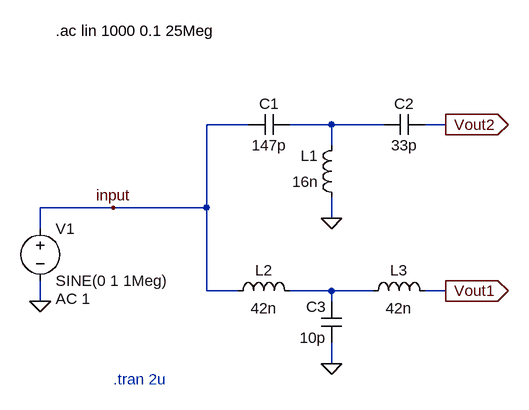
[diagram p0: schematic phase_shifter.asc]
phase_shifter.asc, the LTspice schematic file:
Version 4.1
SHEET 1 880 680
WIRE 80 112 16 112
WIRE 208 112 144 112
WIRE 288 112 208 112
WIRE 384 112 352 112
WIRE 208 144 208 112
WIRE -128 240 -240 240
WIRE 16 240 16 112
WIRE 16 240 -128 240
WIRE 208 256 208 224
WIRE -240 272 -240 240
WIRE 16 368 16 240
WIRE 64 368 16 368
WIRE 208 368 144 368
WIRE 272 368 208 368
WIRE 384 368 352 368
WIRE -240 384 -240 352
WIRE 208 384 208 368
WIRE 208 480 208 448
FLAG 208 256 0
FLAG 208 480 0
FLAG -240 384 0
FLAG 384 112 Vout2
IOPIN 384 112 Out
FLAG 384 368 Vout1
IOPIN 384 368 Out
FLAG -128 240 input
SYMBOL cap 144 96 R90
WINDOW 0 0 32 VBottom 2
WINDOW 3 32 32 VTop 2
SYMATTR InstName C1
SYMATTR Value 147p
SYMBOL cap 352 96 R90
WINDOW 0 0 32 VBottom 2
WINDOW 3 32 32 VTop 2
SYMATTR InstName C2
SYMATTR Value 33p
SYMBOL cap 224 448 R180
WINDOW 0 24 56 Left 2
WINDOW 3 24 8 Left 2
SYMATTR InstName C3
SYMATTR Value 10p
SYMBOL ind 224 240 R180
WINDOW 0 36 80 Left 2
WINDOW 3 36 40 Left 2
SYMATTR InstName L1
SYMATTR Value 16n
SYMBOL ind 48 384 R270
WINDOW 0 32 56 VTop 2
WINDOW 3 5 56 VBottom 2
SYMATTR InstName L2
SYMATTR Value 42n
SYMBOL ind 256 384 R270
WINDOW 0 32 56 VTop 2
WINDOW 3 5 56 VBottom 2
SYMATTR InstName L3
SYMATTR Value 42n
SYMBOL voltage -240 256 R0
WINDOW 123 24 124 Left 2
WINDOW 39 0 0 Left 0
SYMATTR InstName V1
SYMATTR Value SINE(0 1 1Meg)
SYMATTR Value2 AC 1
TEXT -128 504 Left 2 ;.tran 2u
TEXT -216 -32 Left 2 !.ac lin 1000 0.1 25Meg

The netlist it stands for:
* phase_shifter.asc
C1 N001 input 147p
C2 Vout2 N001 33p
C3 0 N002 10p
L1 0 N001 16n
L2 input N002 42n
L3 N002 Vout1 42n
V1 input 0 SINE(0 1 1Meg) AC 1
* .tran 2u
.ac lin 1000 0.1 25Meg
.backanno
.end

* Results of the author's LTspice run, read from the files saved beside the schematic
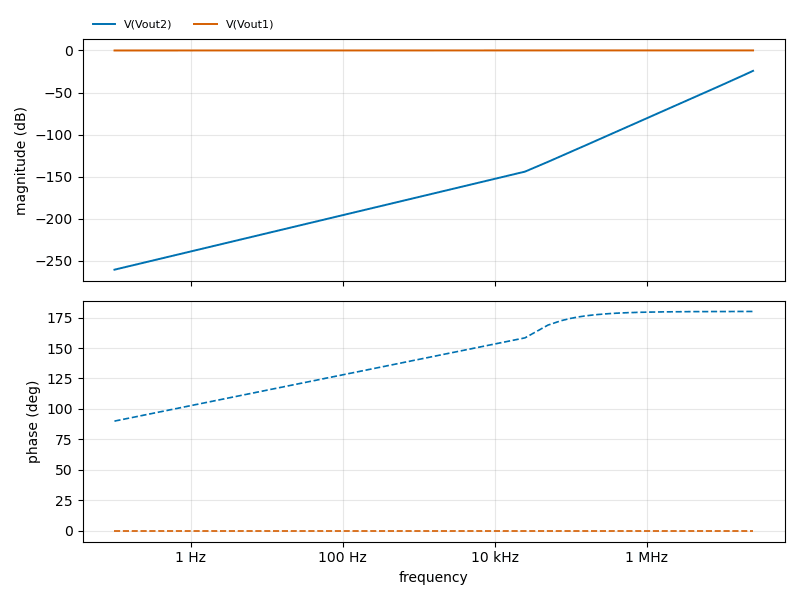
[diagram p1: AC Analysis of phase_shifter.asc, plotted from the saved traces]
* AC Analysis, 1 run:
*   V(Vout2): -260.69 dB at 100 mHz, -24.21 dB at 25 MHz, peak -24.21 dB at 25 MHz, 3 dB below the peak at 21.2 MHz
*   V(Vout1): 0.00 dB at 100 mHz, 0.09 dB at 25 MHz, peak 0.09 dB at 25 MHz